# Altium schematic sheet controleArduino.SchDoc
size A2; SheetNumber: 1; SheetTotal: 2
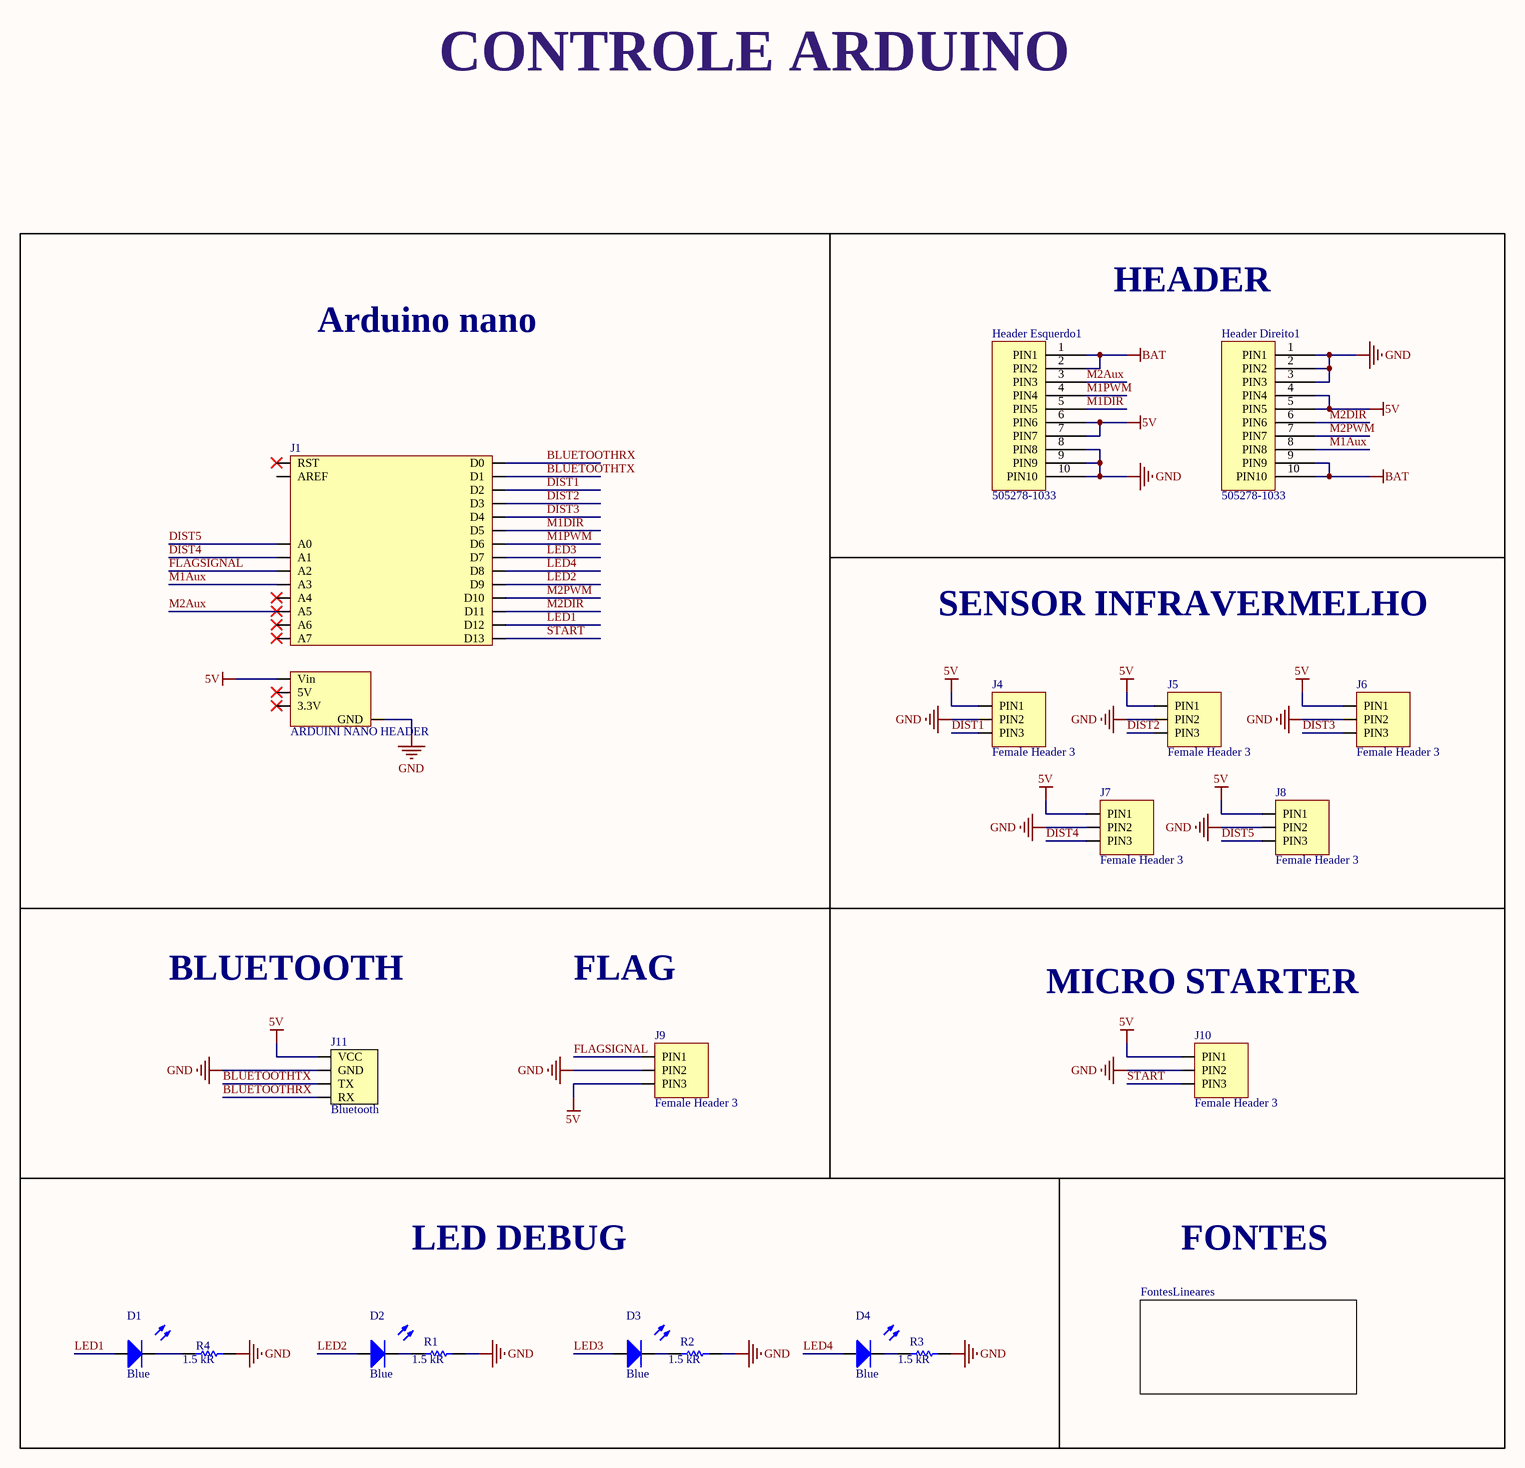
[diagram p0: controleArduino.SchDoc]

## Parts
D1  Blue  [DIODO_2-SMD-3215]
D2  Blue  [DIODO_2-SMD-3215]
D3  Blue  [DIODO_2-SMD-3215]
D4  Blue  [DIODO_2-SMD-3215]
Header_Direito1  505278-1033  [FPC_CON]
Header_Esquerdo1  505278-1033  [FPC_CON]
J1  ARDUINI NANO HEADER  [ARDUINO NANO]
J4  Female Header 3  [FEMALE HEADER 3]
J5  Female Header 3  [FEMALE HEADER 3]
J6  Female Header 3  [FEMALE HEADER 3]
J7  Female Header 3  [FEMALE HEADER 3]
J8  Female Header 3  [FEMALE HEADER 3]
J9  Female Header 3  [FEMALE HEADER 3]
J10  Female Header 3  [FEMALE HEADER 3]
J11  Bluetooth  [BLUETOOTH]
R1  1.5 kR  [RESISTOR_0805]
R2  1.5 kR  [RESISTOR_0805]
R3  1.5 kR  [RESISTOR_0805]
R4  1.5 kR  [RESISTOR_0805]

## Sub-sheets
FontesLineares = FontesLineares: no entries

## Nets
5V: Header_Direito1.4(PIN4) Header_Direito1.5(PIN5) Header_Esquerdo1.6(PIN6) Header_Esquerdo1.7(PIN7) J1.Vin J4.PIN1 J5.PIN1 J6.PIN1 J7.PIN1 J8.PIN1 J9.PIN3 J10.PIN1 J11.VCC
BAT: Header_Direito1.9(PIN9) Header_Direito1.10(PIN10) Header_Esquerdo1.1(PIN1) Header_Esquerdo1.2(PIN2)
GND: Header_Direito1.1(PIN1) Header_Direito1.2(PIN2) Header_Direito1.3(PIN3) Header_Esquerdo1.8(PIN8) Header_Esquerdo1.9(PIN9) Header_Esquerdo1.10(PIN10) J1.GND J4.PIN2 J5.PIN2 J6.PIN2 J7.PIN2 J8.PIN2 J9.PIN2 J10.PIN2 J11.GND R1.2 R2.2 R3.2 R4.2
BLUETOOTHRX: J1.D0 J11.RX
BLUETOOTHTX: J1.D1 J11.TX
DIST1: J1.D2 J4.PIN3
DIST2: J1.D3 J5.PIN3
DIST3: J1.D4 J6.PIN3
DIST4: J1.A1 J7.PIN3
DIST5: J1.A0 J8.PIN3
FLAGSIGNAL: J1.A2 J9.PIN1
LED1: D1.A J1.D12
LED2: D2.A J1.D9
LED3: D3.A J1.D7
LED4: D4.A J1.D8
M1Aux: Header_Direito1.8(PIN8) J1.A3
M1DIR: Header_Esquerdo1.5(PIN5) J1.D5
M1PWM: Header_Esquerdo1.4(PIN4) J1.D6
M2Aux: Header_Esquerdo1.3(PIN3) J1.A5
M2DIR: Header_Direito1.6(PIN6) J1.D11
M2PWM: Header_Direito1.7(PIN7) J1.D10
START: J1.D13 J10.PIN3
NetD1_C: D1.C R4.1
NetD2_C: D2.C R1.1
NetD3_C: D3.C R2.1
NetD4_C: D4.C R3.1

Not connected (* = marked no-connect by the designer): J1 3.3V* 5V* A4* A6* A7* AREF RST*

## Notes on the sheet
- CONTROLE ARDUINO
- HEADER
- Arduino nano
- SENSOR INFRAVERMELHO
- BLUETOOTH
- FLAG
- MICRO STARTER
- LED DEBUG
- FONTES

## Library data of the parts
D1-D4 = EAST3215BA5: LED 75mW BLUE 45MCD 3215; Manufacturer: Everlight Electronics; Current - Forward (If): 20 mA; Voltage - Forward (Vf): 3,30 V; Viewing Angle: 130°; Wavelength: 468 nm; Reverse Voltage: 5 V; Library Control - Checked Footprint: yes; Library Control - Person that Checked Footprint: Lucas; Library Control - Person that did the Last Update Footprint: Stéfany (Ster); Supplier 1: Mouser; Part Number: EAST3215BA5; Category: Standard LEDs - SMD; Price: 1 = 0,3800, 10 = 0,2050, 100 = 0.1080 (USD); Package / Case: 3215; Color: Blue; Operating Temperature: - 40 °C ~ 85 °C; Luminous Intensity: 45 mcd; Library Ref: Diodo/Led; Supplier Part Number 1: 638-EAST3215BA5; Max Power Dissipation: 75 mW; Max Current Rating: 20 mA; Library Control - Checked Schematic: yes; Library Control - Last Update: 13/06/2021 12:45; Library Control - Person that Checked Schematic: Lucas; Library Control - Person that did the Last Update Schematic: Stéfany (Ster); ComponentLink1Description: Mouser Link; ComponentLink1URL: https://www.mouser.com/ProductDetail/Everlight/EAST3215BA5?qs=Cqqh%252BS766wnzp9nQVj5A4g==; ComponentLink2Description: Datasheet; ComponentLink2URL: https://www.mouser.com/datasheet/2/143/EAST3215BA5-1154292.pdf
Header_Direito1 Header_Esquerdo1 = 505278-1033_BODY: CONN FFC/FPC HORZ 10POS 0.50MM; Manufacturer: Molex; Current Rating (Amps): 500mA; Number of Positions: 10; Library Control - Checked Footprint: Yes; Library Control - Last Project that Used: Follow-Final; Library Control - Person that Checked Footprint: Lucas; Library Control - Person that did the Last Update Footprint: Mateus(Dimas); Supplier 1: Mouser; Part Number: 505278-1033; Category: Connectors; Price: 1=0,51000, 10=0,42900, 100=0,33400 (USD); Mounting Type: Right Angle; Contact Material: Tin; Operating Temperature: -40°C ~ 85°C; Library Ref: Connectors; Number of Rows: 1; Termination: SMD; Insulation Material: Liquid Crystal Polymer; Contact Type: FFC/FPC; Pitch: 0.50mm; Contact Length - Mating: 0.50mm; Supplier Part Number 1: 538-505278-1033; Library Control - Checked Schematic: Yes; Library Control - Last Update: 24/04/2021 00:25; Library Control - Person that Checked Schematic: Lucas; Library Control - Person that did the Last Update Schematic: Mateus(Dimas); ComponentLink1Description: Datasheet; ComponentLink1URL: https://br.mouser.com/datasheet/2/276/2/5052781033_FFC_FPC_CONNECTORS-772019.pdf; ComponentLink2Description: Mouser Link; ComponentLink2URL: https://br.mouser.com/ProductDetail/Molex/505278-1033?qs=c8NFF48pVsDStgrQCBOSTg%3D%3D
J1 = Header Arduino Nano
J4-J10 = Female Header 3: Number of Contacts: 3; System: Connector; Library Ref: Header
J11 = Barramento Bluetooth: BARRAMENTO BLUETOOTH HC-06; Number of Contacts: 4; Bluetooth Mode: Slave Only; Operating Voltage: 3,6 / 6 (V); Max Range: 10m; Frequency: 2,4 GHz; Modulation: GFSK (Gaussian Frequency Shift Keying); Recomended Operating Configuration: 5V @ 50mA; Maximum Serial Transmission Rate: 9600 bps; Library Ref: Header
R1-R4 = CRCW08051K50FKEAC: RES SMD 1.5K OHM 1% 1/8W 0805; Manufacturer: Vishay / Dale; Temperature Coefficient: 100 PPM / C; Power Rating: 125 mW (1/8 W); Voltage Rating: 150 V; Library Control - Checked Footprint: Yes; Library Control - Person that Checked Footprint: Nikaum; Library Control - Person that did the Last Update Footprint: Nicolas; Supplier 1: Mouser; Part Number: CRCW08051K50FKEAC; Category: Thick Film Resistors - SMD; Price: 1=0,10, 10=0,059, 100=0,024 (USD); Package / Case: 0805 (2012 Metric); Operating Temperature: -55 C ~ 155 C; Value: 1.5 kR; Tolerance: 1 %; Library Ref: Resistor; Resistor Type: Fixo; Size / Dimension: 2,00 L x 1,25 W x 0,45 H; Supplier Part Number 1: 71-CRCW08051K50FKEAC; Library Control - Checked Schematic: Yes; Library Control - Last Update: 27/06/2021 20:45; Library Control - Person that Checked Schematic: Nikaum; Library Control - Person that did the Last Update Schematic: Nikaum; ComponentLink1Description: Mouser Link; ComponentLink1URL: https://br.mouser.com/ProductDetail/Vishay-Dale/CRCW08051K50FKEAC?qs=E3Y5ESvWgWMwo6R2oqPQ9Q%3D%3D; ComponentLink2Description: Datasheet; ComponentLink2URL: https://br.mouser.com/datasheet/2/427/crcwce3-1762584.pdf